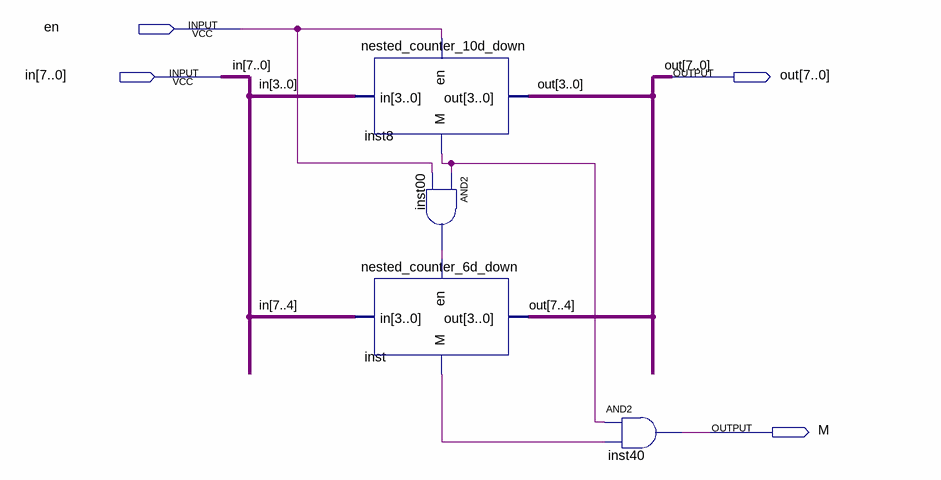
[diagram p0: schematic sheet]
// Quartus schematic nested_counter_60d_down.bdf as structural Verilog: 4 symbols, 4 pins
module nested_counter_60d_down (
  input  en,
  input  [7:0] in,
  output [7:0] out,
  output M
);

  wire inst00_out, inst8_m, inst_m;

  nested_counter_10d_down inst8 (.en(en), .in(in[3:0]), .out(out[3:0]), .M(inst8_m));
  and inst00 (inst00_out, inst8_m, en);
  nested_counter_6d_down inst (.en(inst00_out), .in(in[7:4]), .out(out[7:4]), .M(inst_m));
  and inst40 (M, inst8_m, inst_m);
endmodule
